# Altium schematic sheet 03-CameraSensor.SchDoc
size A4; SheetNumber: 3; SheetTotal: 5
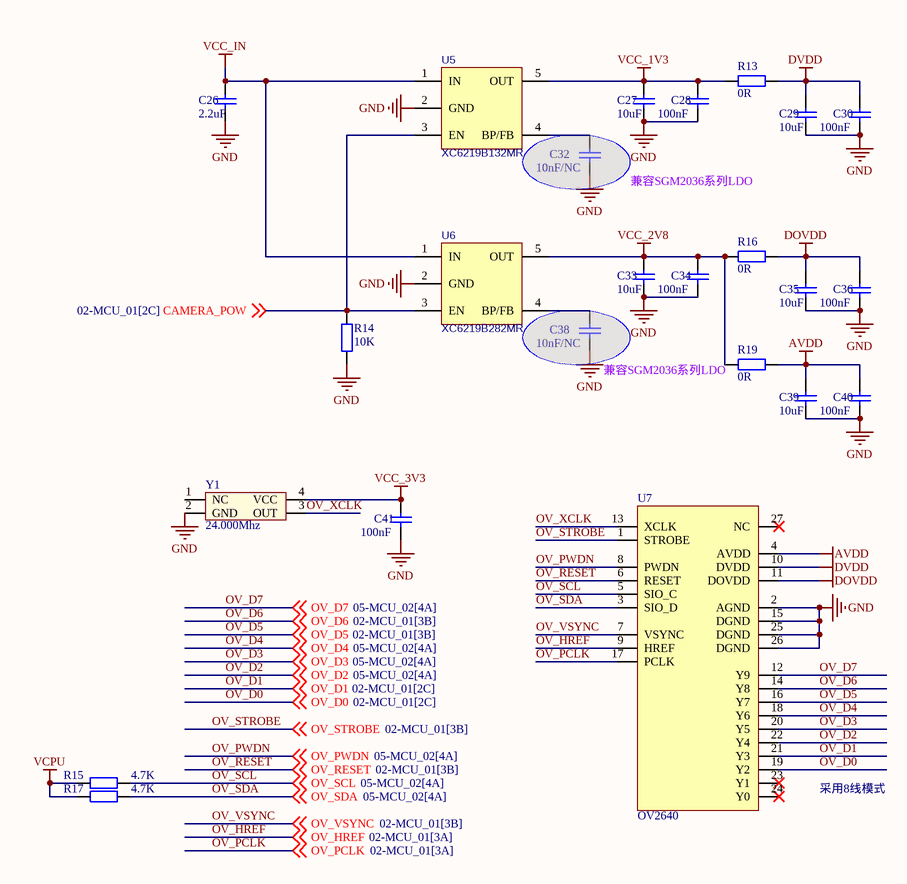
[diagram p0: 03-CameraSensor.SchDoc]

## Parts
C26  2.2uF  [C0603_M]
C27  10uF  [C0603_M]
C28  100nF  [C0603_M]
C29  10uF  [C0603_M]
C30  100nF  [C0603_M]
C32  10nF/NC  [C0603_M]
C33  10uF  [C0603_M]
C34  100nF  [C0603_M]
C35  10uF  [C0603_M]
C36  100nF  [C0603_M]
C38  10nF/NC  [C0603_M]
C39  10uF  [C0603_M]
C40  100nF  [C0603_M]
C41  100nF  [C0603_M]
R13  0R  [R0603_M]
R14  10K  [R0603_M]
R15  4.7K  [R0402_M]
R16  0R  [R0603_M]
R17  4.7K  [R0402_M]
R19  0R  [R0603_M]
U5  XC6219B132MR  [SOT-23-5]
U6  XC6219B282MR  [SOT-23-5]
U7  OV2640  [OV2640-24]
Y1  24.000Mhz  [XTAL3225]

## Nets
AVDD: C39.2 C40.2 R19.2 U7.4(AVDD)
DOVDD: C35.2 C36.2 R16.2 U7.11(DOVDD)
DVDD: C29.2 C30.2 R13.2 U7.10(DVDD)
GND: C26.1 C27.1 C28.1 C29.1 C30.1 C32.1 C33.1 C34.1 C35.1 C36.1 C38.1 C39.1 C40.1 C41.1 R14.1 U5.2(GND) U6.2(GND) U7.2(AGND) U7.15(DGND) U7.25(DGND) U7.26(DGND) Y1.2(GND)
VCC_1V3: C27.2 C28.2 R13.1 U5.5(OUT)
VCC_2V8: C33.2 C34.2 R16.1 R19.1 U6.5(OUT)
VCC_3V3: C41.2 Y1.4(VCC)
VCC_IN: C26.2 U5.1(IN) U6.1(IN)
VCPU: R15.2 R17.2
CAMERA_POW: R14.2 U5.3(EN) U6.3(EN) ; off-sheet CAMERA_POW
OV_D0: U7.19(Y2) ; off-sheet OV_D0
OV_D1: U7.21(Y3) ; off-sheet OV_D1
OV_D2: U7.22(Y4) ; off-sheet OV_D2
OV_D3: U7.20(Y5) ; off-sheet OV_D3
OV_D4: U7.18(Y6) ; off-sheet OV_D4
OV_D5: U7.16(Y7) ; off-sheet OV_D5
OV_D6: U7.14(Y8) ; off-sheet OV_D6
OV_D7: U7.12(Y9) ; off-sheet OV_D7
OV_HREF: U7.9(HREF) ; off-sheet OV_HREF
OV_PCLK: U7.17(PCLK) ; off-sheet OV_PCLK
OV_PWDN: U7.8(PWDN) ; off-sheet OV_PWDN
OV_RESET: U7.6(RESET) ; off-sheet OV_RESET
OV_SCL: R15.1 U7.5(SIO_C) ; off-sheet OV_SCL
OV_SDA: R17.1 U7.3(SIO_D) ; off-sheet OV_SDA
OV_STROBE: U7.1(STROBE) ; off-sheet OV_STROBE
OV_VSYNC: U7.7(VSYNC) ; off-sheet OV_VSYNC
OV_XCLK: U7.13(XCLK) Y1.3(OUT)
NetC32_2: C32.2 U5.4(BP/FB)
NetC38_2: C38.2 U6.4(BP/FB)

Not connected (* = marked no-connect by the designer): U7 23(Y1)* 24(Y0)* 27(NC)*; Y1 1(NC)

## Notes on the sheet
- 兼容SGM2036系列LDO
- (near C38) 兼容SGM2036系列LDO
- 采用8线模式

## Library data of the parts
C26-C30 C32-C36 C38-C41 = C: 贴片电容/MLCC电容; BOM名称: 无极性贴片电容; 当前库版本V2023.8.14 @淘宝卖家:黄晶宝石: 最新版本发布https://item.taobao.com/item.htm?id=566775463719; 联系下单店铺卖家 免费帮你查找封装: 联系下单店铺卖家 免费技术支持
  C26: value: 2.2uF
  C27 C29 C33 C35 C39: value: 10uF
  C28 C30 C34 C36 C40 C41: value: 100nF
  C32 C38: value: 10nF/NC
R13-R17 R19 = R: 贴片电阻; 联系下单店铺卖家 免费帮你查找封装: 联系下单店铺卖家 免费技术支持; BOM名称: 贴片电阻
  R13 R16 R19: value: 0R
  R14: value: 10K
  R15 R17: value: 4.7K
U5 U6 = SGM2019-1.8YN5G: LDO 1.8V/0.3A; 当前库版本V2023.8.14 @淘宝卖家:黄晶宝石: 最新版本发布https://item.taobao.com/item.htm?id=566775463719; BOM名称: SGM2019-1.8YN5G
Y1 = XTAL_S: 有源晶振